# EAGLE design jalo8.3 (EAGLE 5.00)
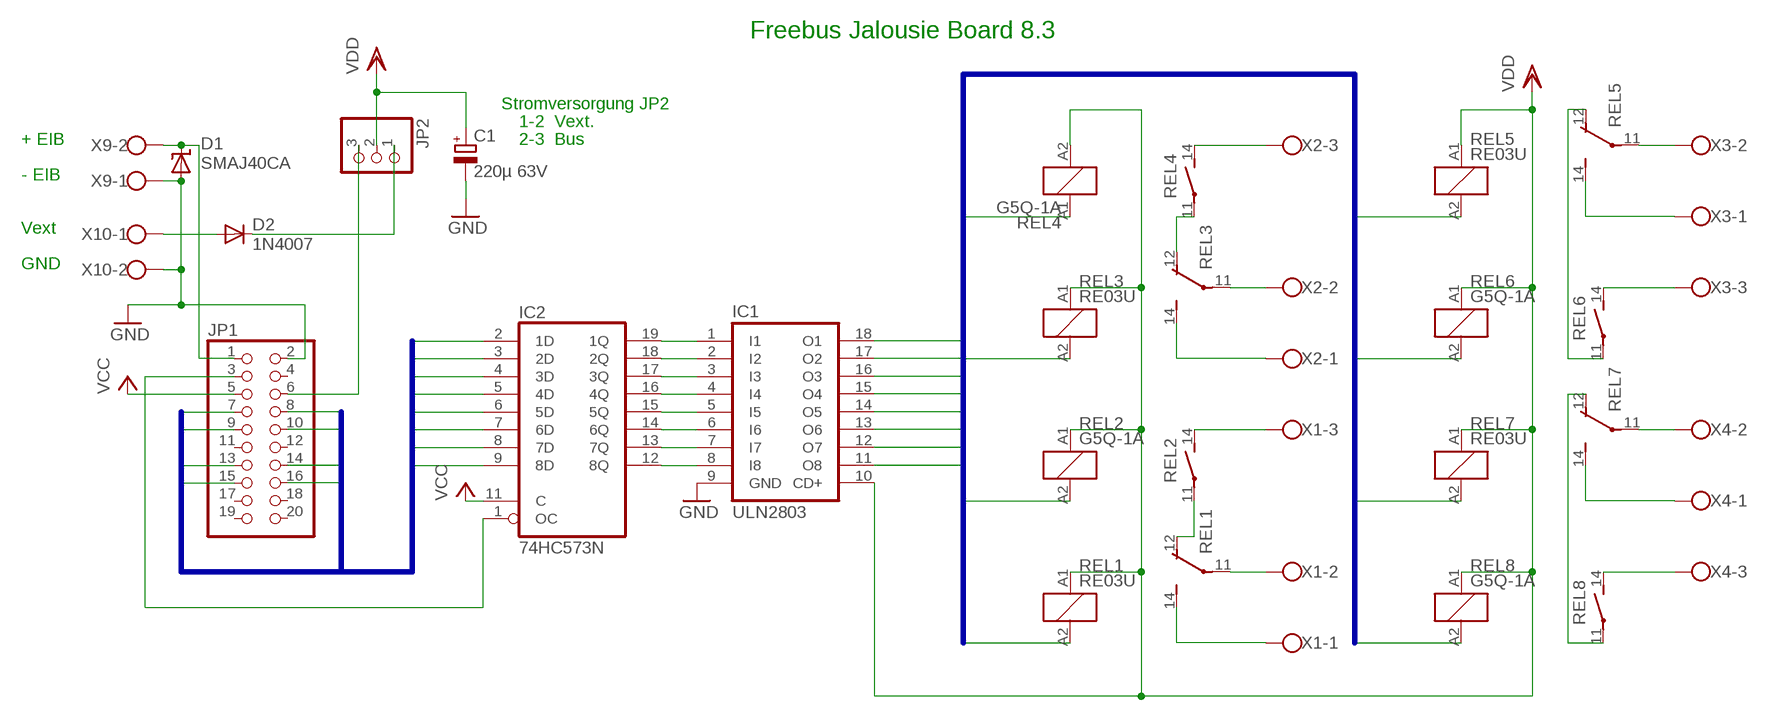
[diagram p0: schematic, sheet 1]

## Parts
C1  220µ 63V  CPOL-EUTT5D10  [TT5D10]
D1  SMAJ40CA  SUPPRESSOR-SMBJ  [SMBJ]
D2  1N4007  1N4004  [DO41-10]
IC1  ULN2803  ULN2803A  [DIL18]
IC2  74HC573N  [DIL20]
JP1  PINHD-2X10  [2X10]
JP2  PINHD-1X3  [1X03]
REL1  RE03U  [G5Q_1_EU]
REL2  G5Q-1A  RE030024  [RE-SCHRACK]
REL3  RE03U  [G5Q_1_EU]
REL4  G5Q-1A  RE030024  [RE-SCHRACK]
REL5  RE03U  [G5Q_1_EU]
REL6  G5Q-1A  RE030024  [RE-SCHRACK]
REL7  RE03U  [G5Q_1_EU]
REL8  G5Q-1A  RE030024  [RE-SCHRACK]
X1  W237-03P  [W237-133]
X2  W237-03P  [W237-133]
X3  W237-03P  [W237-133]
X4  W237-03P  [W237-133]
X9  W237-102  [W237-102]
X10  W237-102  [W237-102]

## Nets
GND: C1.- D1.A IC1.9(GND) JP1.2 X9.1 X10.2
IO1: IC2.2(1D) JP1.16
IO2: IC2.3(2D) JP1.15
IO3: IC2.4(3D) JP1.14
IO4: IC2.5(4D) JP1.13
IO5: IC2.6(5D) JP1.10
IO6: IC2.7(6D) JP1.9
IO7: IC2.8(7D) JP1.8
IO8: IC2.9(8D) JP1.7
N$1: REL3.12(14:O) REL4.11(2:P)
N$2: REL4.14(2:S) X2.3
N$3: REL1.12(14:O) REL2.11(2:P)
N$4: REL1.11(14:P) X1.2
N$5: REL3.11(14:P) X2.2
N$6: REL2.14(2:S) X1.3
N$7: REL7.11(14:P) X4.2
N$8: REL5.11(14:P) X3.2
N$9: REL1.14(14:S) X1.1
N$10: REL5.12(14:O) REL6.11(2:P)
N$13: REL3.14(14:S) X2.1
N$14: REL6.14(2:S) X3.3
N$15: REL8.14(2:S) X4.3
N$16: REL7.14(14:S) X4.1
N$17: D2.A X10.1
N$18: JP1.6 JP2.3
N$19: REL5.14(14:S) X3.1
N$20: D1.C JP1.1 X9.2
N$21: IC1.1(I1) IC2.19(1Q)
N$22: IC1.2(I2) IC2.18(2Q)
N$23: IC1.3(I3) IC2.17(3Q)
N$24: IC1.4(I4) IC2.16(4Q)
N$25: IC1.5(I5) IC2.15(5Q)
N$27: IC1.6(I6) IC2.14(6Q)
N$28: IC1.7(I7) IC2.13(7Q)
N$29: IC1.8(I8) IC2.12(8Q)
N$30: REL7.12(14:O) REL8.11(2:P)
N$31: D2.C JP2.1
N$33: IC2.1(OC) JP1.3
R1: IC1.14(O5) REL4.A1
R2: IC1.13(O6) REL3.A2
R3: IC1.12(O7) REL2.A2
R4: IC1.11(O8) REL1.A2
R5: IC1.15(O4) REL5.A2
R6: IC1.16(O3) REL6.A2
R7: IC1.17(O2) REL7.A2
R8: IC1.18(O1) REL8.A2
VCC: IC2.11(C) JP1.5
VDD: C1.+ IC1.10(CD+) JP2.2 REL1.A1 REL2.A1 REL3.A1 REL4.A2 REL5.A1 REL6.A1 REL7.A1 REL8.A1
Unconnected: JP1.4 JP1.11 JP1.12 JP1.17 JP1.18 JP1.19 JP1.20

## Buses
R[1..8]
IO[1..8]

## Notes on the sheet
- Freebus Jalousie Board 8.3
- Stromversorgung JP2
- 1-2  Vext.
- + EIB | 2-3  Bus
- - EIB
- Vext
- GND

## Power pins joined to a net without a drawn wire
GND: IC2.10(GND)
VCC: IC2.20(VCC)

## Library data of the parts
C1 = rcl:CPOL-EU: POLARIZED CAPACITOR, European symbol
D1 = diode:SUPPRESSOR-: Suppressor diode
D2 = diode:1N4004: DIODE general purpose rectifier, 1 A
IC1 = uln-udn:ULN2803A: DRIVER ARRAY
IC2 = 74xx-eu:74*573: 8-bit D latch BUS DRIVER
JP1 = pinhead:PINHD-2X10: PIN HEADER
JP2 = pinhead:PINHD-1X3: PIN HEADER
REL1 REL3 REL5 REL7 = freebus_relay:RE03U
REL2 REL4 REL6 REL8 = relay:RE03*: Miniature PCB Relay 1 pole 6 A SCHRACK Source: http://www.schrack.com/.. 5812.pdf
X1-X4 = con-wago-508:W237-03P: WAGO SREW CLAMP
X9 X10 = con-wago-500:W237-102: WAGO SCREW CLAMP

## Board
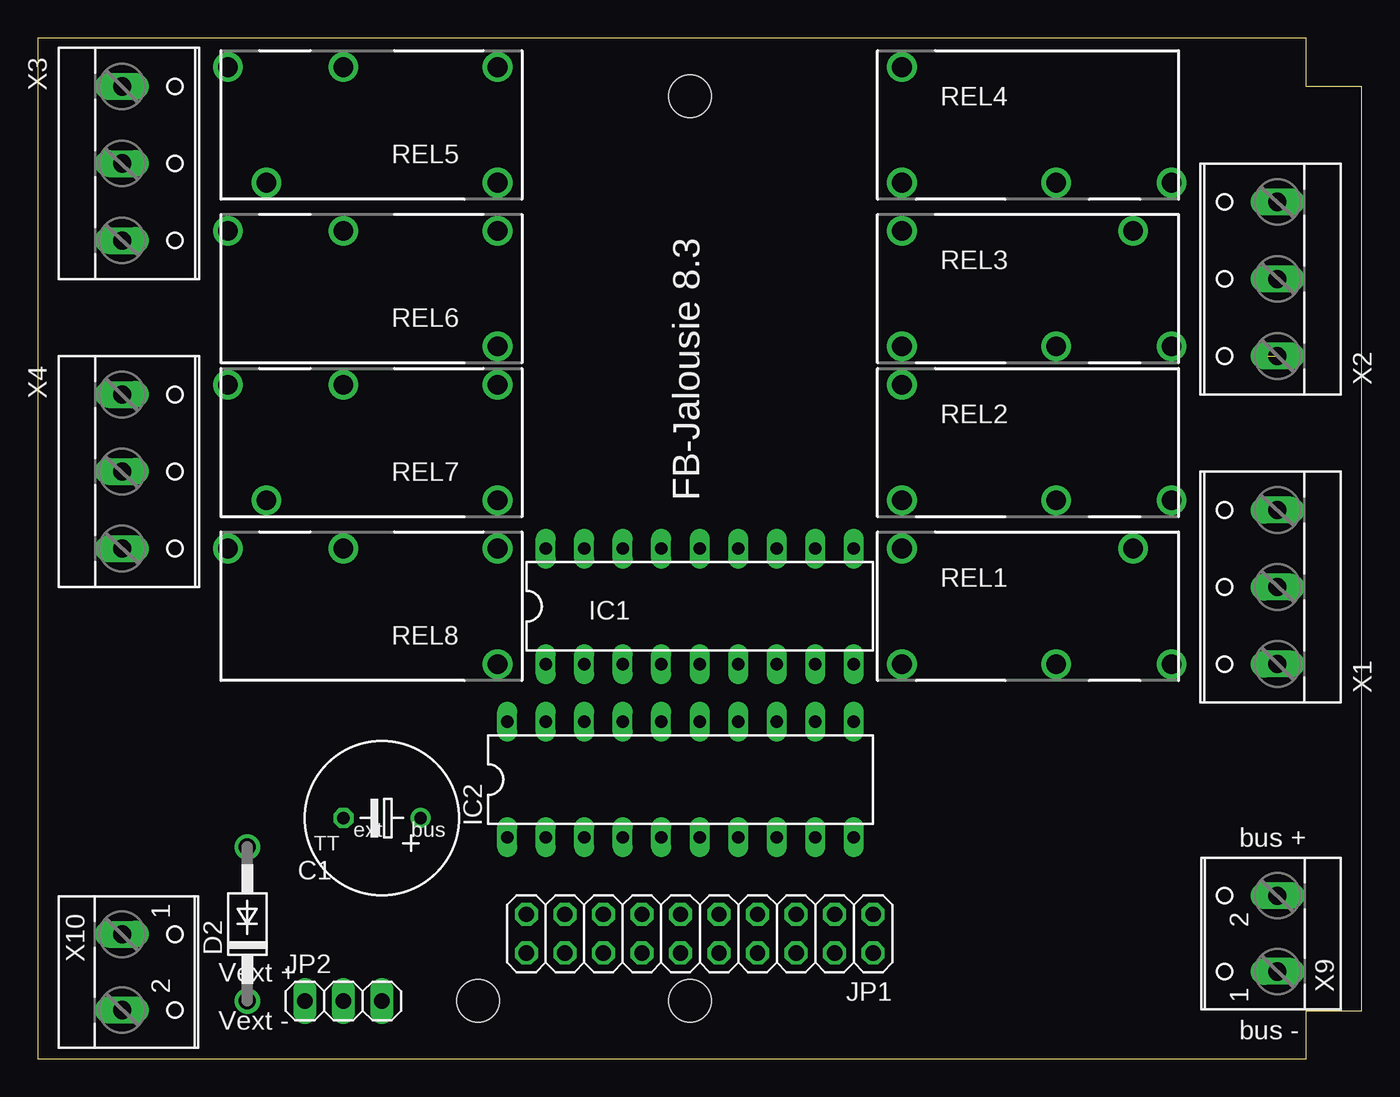
[diagram p1: board, top side]
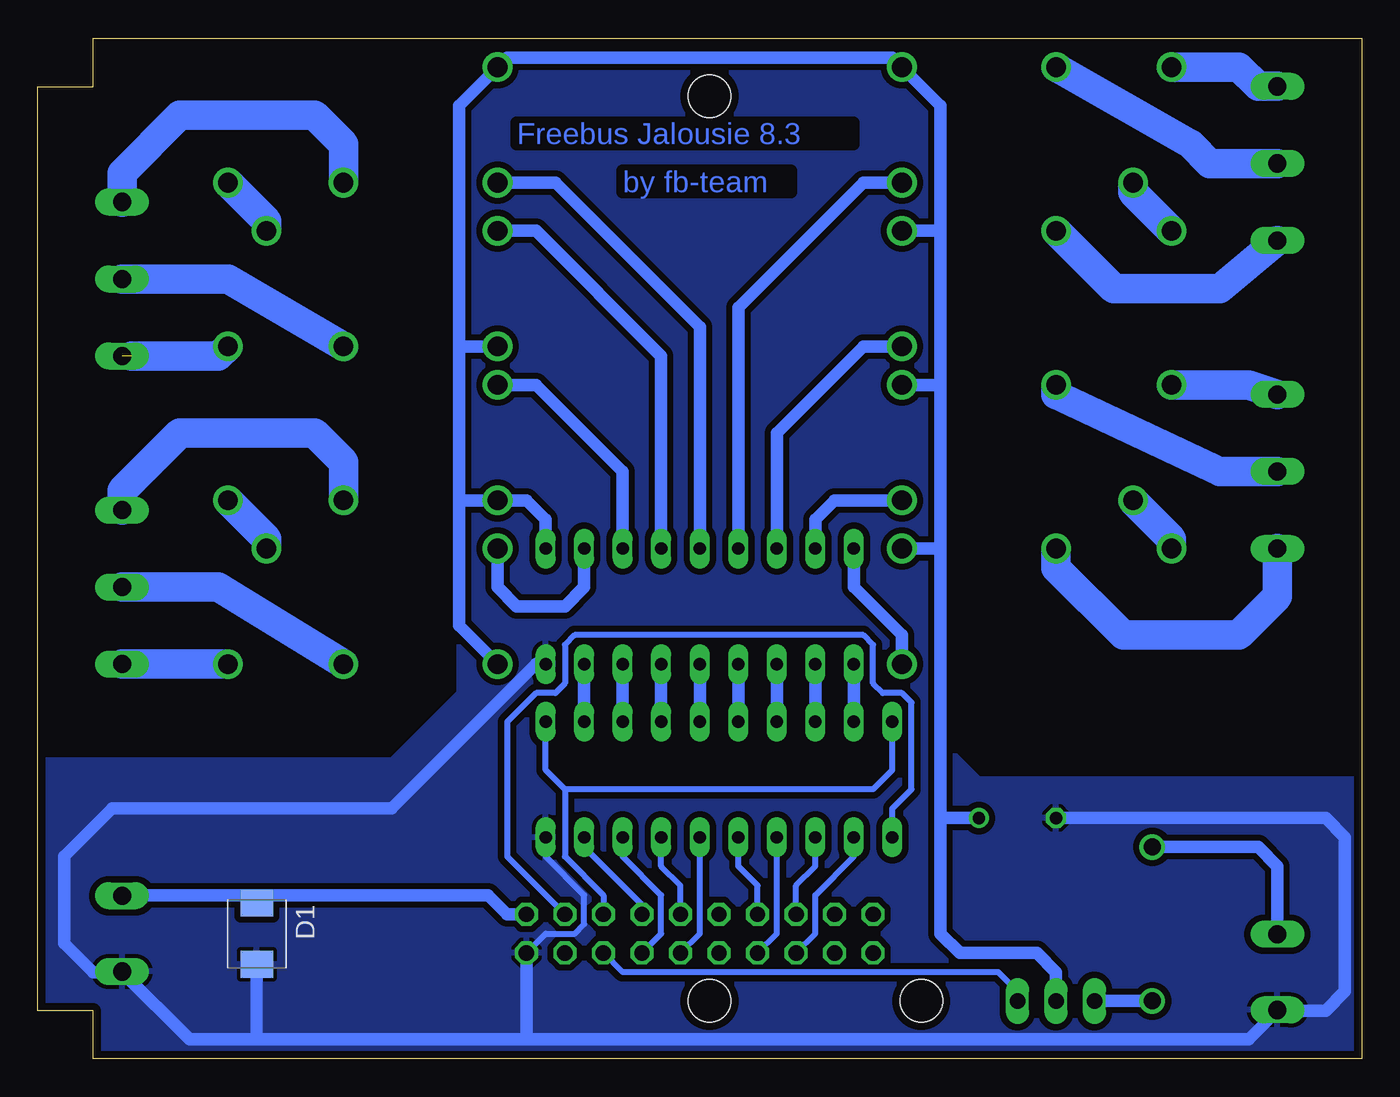
[diagram p2: board, bottom side, seen from below]

Size 87.3 x 67.31 mm. Coordinates in mm from the lower left corner, seen from the top.
Outline: 0,0.01 83.66,0 83.66,3.18 87.3,3.18 87.3,64.13 83.66,64.13 83.66,67.31 0,67.31 0,0.01
Copper layers (1*16): Top 0.035mm / dielectric 1.5mm / Bottom 0.035mm
Design rules "default *": minimum track width 10mil, minimum drill 24mil, track to track 16mil, track to pad 16mil, pad to pad 16mil, via to via 16mil, smd to smd 8mil, copper to edge 20mil, drill to drill 10mil, minimum pad ring 10mil, minimum via ring 8mil, stop-mask expansion 4mil, vias tented up to drill 0mil, thermal gap 10mil
Holes 2.8 mm at 43.02,3.81 43.02,63.5 29.04,3.81

### Footprints (pad centres in the part's own frame; a part is rotated, then mirrored left to right if it is on the bottom)
TT5D10 = drill 0.813 round: + -2.54,0 | drill 0.813 octagon: - 2.54,0
SMBJ = smd 1.78 x 2.16: A 2.04,0; C -2.03,0
DO41-10 = drill 1.118 round: A 5.08,0; C -5.08,0
DIL18 = drill 0.813 long: 1 -10.16,-3.81; 2 -7.62,-3.81; 3 -5.08,-3.81; 4 -2.54,-3.81; 5 0,-3.81; 6 2.54,-3.81; 7 5.08,-3.81; 8 7.62,-3.81; 9 10.16,-3.81; 10 10.16,3.81; 11 7.62,3.81; 12 5.08,3.81; 13 2.54,3.81; 14 0,3.81; 15 -2.54,3.81; 16 -5.08,3.81; 17 -7.62,3.81; 18 -10.16,3.81
DIL20 = drill 0.813 long: 1 -11.43,-3.81; 2 -8.89,-3.81; 3 -6.35,-3.81; 4 -3.81,-3.81; 5 -1.27,-3.81; 6 1.27,-3.81; 7 3.81,-3.81; 8 6.35,-3.81; 9 8.89,-3.81; 10 11.43,-3.81; 11 11.43,3.81; 12 8.89,3.81; 13 6.35,3.81; 14 3.81,3.81; 15 1.27,3.81; 16 -1.27,3.81; 17 -3.81,3.81; 18 -6.35,3.81; 19 -8.89,3.81; 20 -11.43,3.81
2X10 = drill 1.016 octagon: 1 -11.43,-1.27; 2 -11.43,1.27; 3 -8.89,-1.27; 4 -8.89,1.27; 5 -6.35,-1.27; 6 -6.35,1.27; 7 -3.81,-1.27; 8 -3.81,1.27; 9 -1.27,-1.27; 10 -1.27,1.27; 11 1.27,-1.27; 12 1.27,1.27; 13 3.81,-1.27; 14 3.81,1.27; 15 6.35,-1.27; 16 6.35,1.27; 17 8.89,-1.27; 18 8.89,1.27; 19 11.43,-1.27; 20 11.43,1.27
1X03 = drill 1.016 long: 1 -2.54,0; 2 0,0; 3 2.54,0
G5Q_1_EU = drill 1.3 round: 11 1.27,-3.81; 12 6.35,3.81; 14 8.89,-3.81; A1 -8.89,-3.81; A2 -8.89,3.81
RE-SCHRACK = drill 1.3 round: 11 8.89,-3.81; 14 1.27,-3.81; A1 -8.89,-3.81; A2 -8.89,3.81
W237-133 = drill 1.194 long: 1 -5.08,-0.635; 2 0,-0.635; 3 5.08,-0.635
W237-102 = drill 1.194 long: 1 -2.5,-1.27; 2 2.5,-1.27

### Placement (x,y rotation side)
C1  22.7,15.88 180 top
D1  72.86,8.26 270 bottom
D2  13.81,8.89 90 top
IC1  43.65,29.85 0 top
IC2  42.38,18.42 0 top
JP1  43.65,8.26 180 top
JP2  20.15,3.81 0 top
REL1  65.88,29.85 0 top
REL2  65.88,40.64 0 top
REL3  65.88,50.8 0 top
REL4  65.88,61.59 0 top
REL5  21.42,61.59 180 top
REL6  21.42,50.8 180 top
REL7  21.42,40.64 180 top
REL8  21.42,29.85 180 top
X1  81.11,31.12 90 top
X2  81.11,51.43 90 top
X3  6.18,59.05 270 top
X4  6.18,38.73 270 top
X9  80.48,8.26 90 top
X10  6.82,5.71 270 top

### Tracks (layer width: path | path; a pad name or v marks a point on that pad's centre or on a via)
GND
  Bottom 0.406: IC2.10 53.81,13.33 51.27,10.79 51.27,8.89 51.91,8.26 53.81,8.26 JP1.2 | 54.45,26.04 IC1.9
  Bottom 0.61: 81.75,5.71 X9.1
  Bottom 0.813: 55.08,1.27 7.46,1.27 5.55,3.17 | 55.08,1.27 72.86,1.27 | 72.86,1.27 77.3,1.27 81.75,5.71 83.66,5.71 85.56,7.62 85.56,13.33 82.39,16.51 63.97,16.51 54.45,26.04 | 55.08,1.27 JP1.2 | C1.- 2.38,15.88 1.1,14.61 1.1,4.45 2.38,3.17 5.55,3.17 | 5.55,3.17 X10.2 | 72.86,1.27 D1.A
  pour Bottom: 0.47,0.64 0.47,18.42 25.23,18.42 27.77,20.96 27.77,62.86 30.95,66.04 56.35,66.04 59.52,62.86 59.52,24.13 63.97,19.69 86.83,19.69 86.83,0.64
IO1
  Bottom 0.406: JP1.16 36.03,8.26 36.03,10.79 33.49,13.33 IC2.2
IO2
  Bottom 0.406: JP1.15 37.3,11.43 36.03,12.7 IC2.3
IO3
  Bottom 0.406: JP1.14 38.57,8.26 IC2.4
IO4
  Bottom 0.406: JP1.13 39.84,11.43 41.11,12.7 IC2.5
IO5
  Bottom 0.406: JP1.10 43.65,8.26 IC2.6
IO6
  Bottom 0.406: JP1.9 44.92,11.43 46.19,12.7 IC2.7
IO7
  Bottom 0.406: JP1.8 46.19,8.26 46.19,10.79 48.73,13.33 IC2.8
IO8
  Bottom 0.406: JP1.7 47.46,10.16 51.27,13.97 IC2.9
N$1
  Bottom 1.93: REL4.11 72.22,55.24 REL3.12
N$2
  Bottom 1.93: REL4.14 67.14,60.32 69.05,62.23 77.94,62.23 81.75,58.42 X2.3
N$3
  Bottom 1.93: REL1.12 72.22,34.29 REL2.11
N$4
  Bottom 1.93: X1.2 75.4,31.12 REL1.11
N$5
  Bottom 1.93: REL3.11 74.77,51.43 X2.2
N$6
  Bottom 1.93: REL2.14 67.14,39.37 69.05,41.27 77.94,41.27 81.75,37.46 X1.3
N$7
  Bottom 1.93: X4.2 9.36,38.73 20.15,43.81 REL7.11
N$8
  Bottom 1.93: X3.2 10,59.05 11.27,60.32 REL5.11
N$9
  Bottom 1.93: REL1.14 X1.1
N$10
  Bottom 1.93: REL6.11 15.08,57.15 REL5.12
N$13  (1 unrouted)
  Bottom 1.93: REL3.14 75.4,46.35 81.11,46.35
N$14
  Bottom 1.93: X3.3 9.36,50.8 16.34,50.8 REL6.14
N$15
  Bottom 1.93: X4.3 5.55,30.48 8.09,27.94 15.71,27.94 20.15,32.38 REL8.14
N$16
  Bottom 1.93: X4.1 7.46,44.45 REL7.14
N$17
  Bottom 0.813: X10.1 5.55,12.7 6.82,13.97 D2.A
N$18
  Bottom 0.406: JP2.3 22.7,4.45 23.96,5.71 48.73,5.71 JP1.6
N$19
  Bottom 1.93: X3.1 6.82,64.14 8.09,65.41 REL5.14
N$20
  Bottom 0.254: X9.2 81.75,10.79
  Bottom 0.61: 80.44,10.75 80.48,10.75 80.48,10.79
  Bottom 0.813: 80.48,10.75 X9.2 | JP1.1 56.35,9.53 57.62,10.79 72.86,10.79 | 72.86,10.79 80.48,10.79 | 72.86,10.79 D1.C
N$21
  Bottom 0.813: IC2.19 IC1.1
N$22
  Bottom 0.813: IC2.18 IC1.2
N$23
  Bottom 0.813: IC2.17 IC1.3
N$24
  Bottom 0.813: IC2.16 IC1.4
N$25
  Bottom 0.813: IC2.15 IC1.5
N$27
  Bottom 0.813: IC2.14 IC1.6
N$28
  Bottom 0.813: IC2.13 IC1.7
N$29
  Bottom 0.813: IC2.12 IC1.8
N$30
  Bottom 1.93: REL8.11 12.54,34.29 REL7.12
N$31
  Bottom 0.813: D2.C JP2.1
N$33
  Bottom 0.406: JP1.3 56.35,13.33 56.35,22.23 54.45,24.13 53.17,24.13 52.54,24.77 52.54,27.31 51.91,27.94 32.85,27.94 32.22,27.31 32.22,24.77 31.58,24.13 30.31,24.13 29.68,23.5 29.68,17.78 30.95,16.51 IC2.1
R1
  Bottom 0.813: REL4.A1 53.17,57.78 43.65,48.26 IC1.14
R2
  Bottom 0.813: IC1.13 46.19,46.35 54.45,54.61 REL3.A2
R3
  Bottom 0.813: REL2.A2 54.45,44.45 48.73,38.73 IC1.12
R4
  Bottom 0.813: IC1.11 51.27,31.12 52.54,29.85 55.71,29.85 56.98,31.12 REL1.A2
R5
  Bottom 0.813: IC1.15 41.11,49.53 32.85,57.78 REL5.A2
R6
  Bottom 0.813: REL6.A2 32.85,46.99 38.57,41.27 IC1.16
R7
  Bottom 0.813: IC1.17 36.03,35.56 34.76,36.83 REL7.A2
R8
  Bottom 0.813: REL8.A2 30.31,27.94 33.49,31.12 IC1.18
VCC
  Bottom 0.406: IC2.20 30.95,19.05 32.22,17.78 51.27,17.78 | 51.27,17.78 52.54,17.78 | 52.54,17.78 52.54,13.33 50,10.79 JP1.5 | 51.27,17.78 52.54,17.78 | 52.54,17.78 53.81,19.05 IC2.11
VDD
  Bottom 0.813: 27.77,33.66 REL8.A1 | 27.77,33.66 27.77,44.45 | 27.77,44.45 27.77,54.61 | 27.77,54.61 REL6.A1 | 27.77,54.61 27.77,62.86 REL5.A1 30.95,66.04 56.35,66.04 REL4.A2 59.52,62.86 59.52,46.99 | 59.52,46.99 59.52,36.83 | 59.52,36.83 59.52,28.58 REL1.A1 | 59.52,36.83 REL2.A1 55.08,36.83 53.81,35.56 IC1.10 | 27.77,44.45 REL7.A1 | 59.52,46.99 REL3.A1 | JP2.2 20.15,5.71 21.42,6.98 26.5,6.98 27.77,8.26 27.77,15.88 | 27.77,15.88 27.77,33.66 | 27.77,15.88 C1.+

### Text on the board
Bottom: Freebus Jalousie 8.3 | by fb-team
tPlace: FB-Jalousie 8.3 | ext | bus | bus + | Vext + | Vext - | bus -